# Altium project Cool.PrjPCB
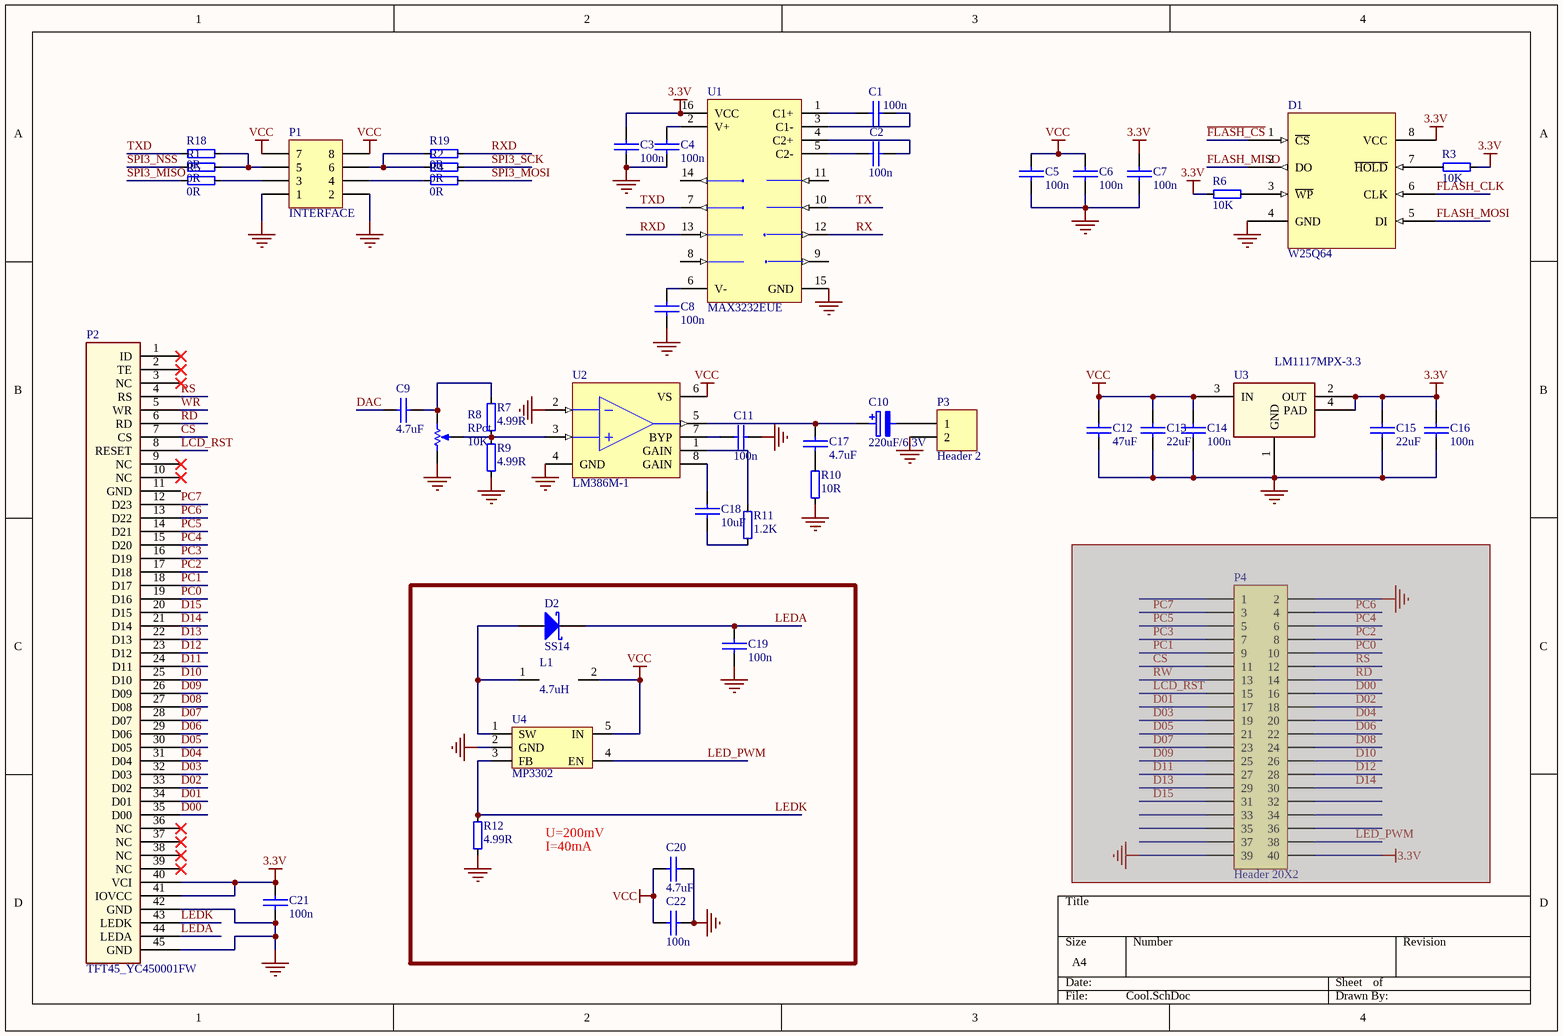
[diagram p0: Cool.SchDoc]
2 sheets, 69 parts. Net scope: global (net labels, ports and power ports of the same name join across sheets).
Board file: Cool.PcbDoc
Sheets:
  Cool.SchDoc
  mcu.SchDoc

## Sheet Cool.SchDoc
size A4

### Parts
C1  100n  [0603]
C2  100n  [0603]
C3  100n  [0603]
C4  100n  [0603]
C5  100n  [0603]
C6  100n  [0603]
C7  100n  [0603]
C8  100n  [0603]
C9  4.7uF  [0603]
C10  220uF/6.3V  [6032]
C11  100n  [0603]
C12  47uF  [1206]
C13  22uF  [1206]
C14  100n  [0603]
C15  22uF  [1206]
C16  100n  [0603]
C17  4.7uF  [0603]
C18  10uF  [0603]
C19  100n  [0603]
C20  4.7uF  [0603]
C21  100n  [0603]
C22  100n  [0603]
D1  W25Q64  [SOIC127P790X200-8N]
D2  SS14  [SOD123]
L1  4.7uH  [SMD4532]
P1  INTERFACE  [P_Head_2x4]
P2  TFT45_YC450001FW  [FPC45]
P3  Header 2  [P_Head_2]
P4  Header 20X2  [P_Head_2x20]  (masked out: inside a compile mask, not in the netlist)
R1  0R  [0603]
R2  0R  [0603]
R3  10K  [0603]
R4  0R  [0603]
R5  0R  [0603]
R6  10K  [0603]
R7  4.99R  [0603]
R8  RPot  value 10K  [VR5]
R9  4.99R  [0603]
R10  10R  [0603]
R11  1.2K  [0603]
R12  4.99R  [0603]
R18  0R  [0603]
R19  0R  [0603]
U1  MAX3232EUE  [TSSOP16]
U2  LM386M-1  [M08A_N]
U3  LM1117MPX-3.3  [SOT223]
U4  MP3302  [sot23-5]

### Nets
3.3V: C3.2 C7.1 C15.1 C16.1 C21.2 D1.8(VCC) P2.40(VCI) P2.41(IOVCC) R3.2 R6.1 U1.16(VCC) U3.2(OUT) U3.4(PAD)
GND: C3.1 C4.1 C5.2 C6.2 C7.2 C8.1 C11.2 C12.2 C13.2 C14.2 C15.2 C16.2 C19.1 C20.2 C21.1 C22.2 D1.4(GND) P1.1 P1.2 P2.42(GND) P2.45(GND) P3.2 R8.1(TOP) R9.1 R10.1 R12.1 U1.15(GND) U2.2(IN-) U2.4(GND) U3.1(GND) U4.2(GND)
VCC: C5.1 C6.1 C12.1 C13.1 C14.1 C20.1 C22.1 L1.2 P1.7 P1.8 U2.6(VS) U3.3(IN) U4.5(IN)
CS: P2.7(CS)
D00: P2.35(D00)
D01: P2.34(D01)
D02: P2.33(D02)
D03: P2.32(D03)
D04: P2.31(D04)
D05: P2.30(D05)
D06: P2.29(D06)
D07: P2.28(D07)
D08: P2.27(D08)
D09: P2.26(D09)
D10: P2.25(D10)
D11: P2.24(D11)
D12: P2.23(D12)
D13: P2.22(D13)
D14: P2.21(D14)
D15: P2.20(D15)
DAC: C9.2
~{FLASH_CS}: D1.1(~{CS})
FLASH_CLK: D1.6(CLK)
FLASH_MISO: D1.2(DO)
FLASH_MOSI: D1.5(DI)
LCD_RST: P2.8(RESET)
LED_PWM: U4.4(EN)
LEDA: C19.2 D2.2(K) P2.44(LEDA)
LEDK: P2.43(LEDK) R12.2 U4.3(FB)
PC0: P2.19(D16)
PC1: P2.18(D17)
PC2: P2.17(D18)
PC3: P2.16(D19)
PC4: P2.15(D20)
PC5: P2.14(D21)
PC6: P2.13(D22)
PC7: P2.12(D23)
RD: P2.6(RD)
RS: P2.4(RS)
RX: U1.12(R1OUT)
RXD: R19.2 U1.13(R1IN)
SPI3_MISO: R5.1
SPI3_MOSI: R4.2
SPI3_NSS: R1.1
SPI3_SCK: R2.2
TX: U1.10(T2IN)
TXD: R18.1 U1.7(T2OUT)
WR: P2.5(WR)
NetC1_1: C1.1 U1.1(C1+)
NetC1_2: C1.2 U1.3(C1-)
NetC2_1: C2.1 U1.5(C2-)
NetC2_2: C2.2 U1.4(C2+)
NetC4_2: C4.2 U1.2(V+)
NetC8_2: C8.2 U1.6(V-)
NetC9_1: C9.1 R7.2 R8.2(BOT)
NetC10_1: C10.1 C17.1 U2.5(OUT)
NetC10_2: C10.2 P3.1
NetC11_1: C11.1 U2.7(BYP)
NetC17_2: C17.2 R10.2
NetC18_1: C18.1 U2.8(GAIN)
NetC18_2: C18.2 R11.1
NetD1_3: D1.3(~{WP}) R6.2
NetD1_7: D1.7(~{HOLD}) R3.1
NetD2_1: D2.1(A) L1.1 U4.1(SW)
NetP1_3: P1.3 R5.2
NetP1_4: P1.4 R4.1
NetP1_5: P1.5 R1.2 R18.2
NetP1_6: P1.6 R2.1 R19.1
NetR7_1: R7.1 R8.3(TAP) R9.2 U2.3(IN+)
NetR11_2: R11.2 U2.1(GAIN)

Not connected (* = marked no-connect by the designer): P2 1(ID)* 2(TE)* 3(NC)* 9(NC)* 10(NC)* 11(GND) 36(NC)* 37(NC)* 38(NC)* 39(NC)*; U1 8(R2IN) 9(R2OUT) 11(T1IN) 14(T1OUT)

### Notes on the sheet
- U=200mV
- I=40mA

### Library data of the parts
C1-C9 C11-C22 = CAP: 贴片瓷片电容
C10 = ELECTRO: 贴片电解电容; Value: 220uF/6.3V
D2 = D Schottky: Schottky Diode; Published: 8-Jun-2000; LatestRevisionDate: 17-Jul-2002; LatestRevisionNote: Re-released for DXP Platform.; PackageReference: SMB; Publisher: Altium Limited; PackageDescription: DO-214-AA/SMB; 2 C-Bend Leads; Body 5.3 x 3.6 mm, inc. leads (LxW); Code_JEDEC: DO-214-AA
L1 = Inductor
P1 = Header 4X2: Header, 4-Pin, Dual row; LatestRevisionDate: 17-Jul-2002; LatestRevisionNote: Re-released for DXP Platform.; Publisher: Altium Limited
P3 = Header 2: Header, 2-Pin; LatestRevisionDate: 17-Jul-2002; LatestRevisionNote: Re-released for DXP Platform.; Publisher: Altium Limited
P4 = Header 20X2: Header, 20-Pin, Dual row; LatestRevisionDate: 17-Jul-2002; LatestRevisionNote: Re-released for DXP Platform.; Publisher: Altium Limited
R1-R7 R9-R12 R18 R19 = RES: 贴片电阻（5%）
R8 = RPot: Potentiometer; Sim Note: Enter the Resistance value and the set point into parameter fields.; Set Position: 0.5; Published: 8-Jun-2000; LatestRevisionDate: 17-Jul-2002; LatestRevisionNote: Re-released for DXP Platform.; PackageReference: VR5; Publisher: Altium Limited
U1 = MAX3232EUE: 3.0V TO 5.5V, Low-Power, up to 1Mbps, True RS-232 Transceiver Using Four 0.1µF External Capacitor; Published: 16-Jan-2001; LatestRevisionDate: 06-Jun-2005; LatestRevisionNote: Stylized 3D Model Added.; DatasheetVersion: Mar-1999; PackageVersion: 21-0066 C; PackageReference: TSSOP16; Publisher: Altium Limited; PackageDescription: Shrink Small Outline; 16 Leads; Body Width 4.4 mm; Pitch 0.65 mm; ComponentLink1Description: Manufacturer Link; ComponentLink1URL: http://www.maxim-ic.com/; ComponentLink2Description: Datasheet; ComponentLink2URL: http://pdfserv.maxim-ic.com/en/ds/MAX3222-MAX3241.pdf
U2 = LM386M-1: Low-Voltage Audio Power Amplifier; Published: 15-Apr-2002; LatestRevisionDate: 13-Apr-2006; LatestRevisionNote: IPC-7351 Footprint Added.; DatasheetVersion: Sep-1997; PackageVersion: Sep-1997; PackageReference: M08A; Publisher: Altium Limited; PackageDescription: 8-Pin Small Outline Integrated Circuit 1.27 mm Pitch; Code_JEDEC: MS-012-AA; Code_IPC: SOIC127P600-8; ComponentLink1Description: Manufacturer Link; ComponentLink1URL: http://www.national.com/; ComponentLink2Description: Datasheet; ComponentLink2URL: http://www.national.com/ds.cgi/LM/LM386.pdf; ComponentLink3Description: URL Link1; ComponentLink3URL: http://www.national.com/pf/LM/LM386.html
U3 = LM1117: 电源LDO

## Sheet mcu.SchDoc
size A4
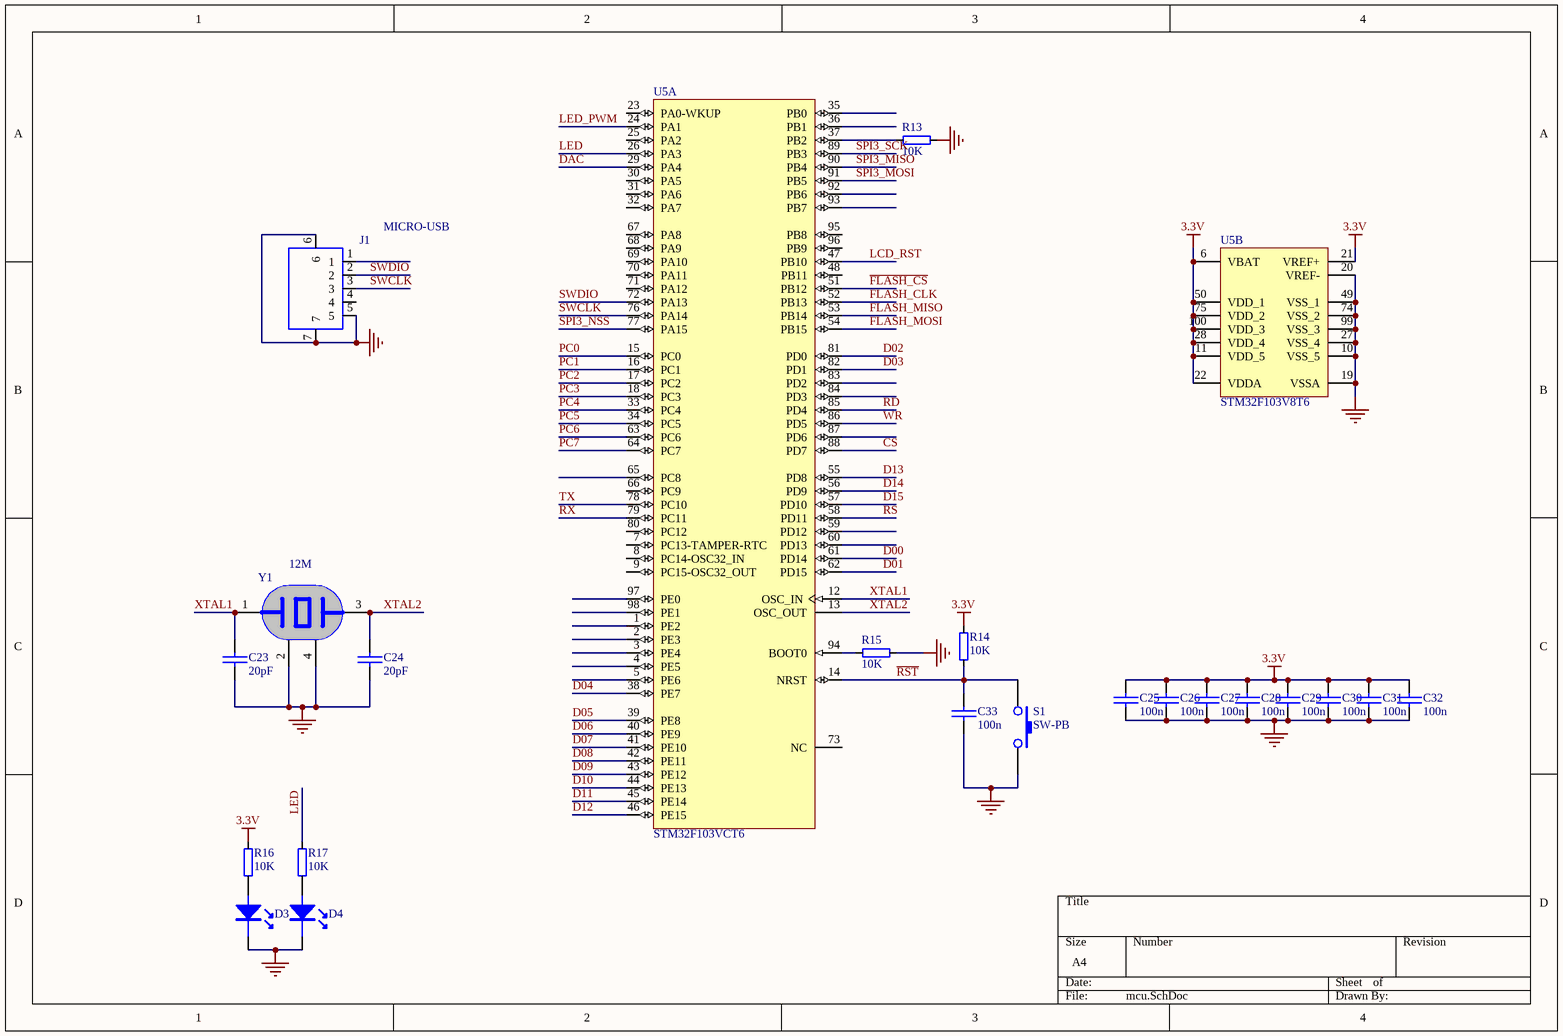
[diagram p1: mcu.SchDoc]

### Parts
C23  20pF  [0603]
C24  20pF  [0603]
C25  100n  [0603]
C26  100n  [0603]
C27  100n  [0603]
C28  100n  [0603]
C29  100n  [0603]
C30  100n  [0603]
C31  100n  [0603]
C32  100n  [0603]
C33  100n  [0603]
D3  LED  [0603-LED]  (value not drawn)
D4  LED  [0603-LED]  (value not drawn)
J1  MICRO-USB  [MICRO-USB]
R13  10K  [0603]
R14  10K  [0603]
R15  10K  [0603]
R16  10K  [0603]
R17  10K  [0603]
S1  SW-PB  [KEY6*4]
U5  STM32F103VCT6  [STM-LQFP100_N]  (parts A,B of 2)
Y1  12M  [XTAL-SMD3225]

### Nets
3.3V: C25.1 C26.1 C27.1 C28.1 C29.1 C30.1 C31.1 C32.1 R14.2 R16.2 U5.6(VBAT) U5.11(VDD_5) U5.21(VREF+) U5.22(VDDA) U5.28(VDD_4) U5.50(VDD_1) U5.75(VDD_2) U5.100(VDD_3)
GND: C23.2 C24.2 C25.2 C26.2 C27.2 C28.2 C29.2 C30.2 C31.2 C32.2 C33.2 D3.2(K) D4.2(K) J1.5 J1.6 J1.7 R13.2 R15.2 S1.2 U5.10(VSS_5) U5.19(VSSA) U5.20(VREF-) U5.27(VSS_4) U5.49(VSS_1) U5.74(VSS_2) U5.99(VSS_3) Y1.2 Y1.4
CS: U5.88(PD7)
D00: U5.61(PD14)
D01: U5.62(PD15)
D02: U5.81(PD0)
D03: U5.82(PD1)
D04: U5.38(PE7)
D05: U5.39(PE8)
D06: U5.40(PE9)
D07: U5.41(PE10)
D08: U5.42(PE11)
D09: U5.43(PE12)
D10: U5.44(PE13)
D11: U5.45(PE14)
D12: U5.46(PE15)
D13: U5.55(PD8)
D14: U5.56(PD9)
D15: U5.57(PD10)
DAC: U5.29(PA4)
~{FLASH_CS}: U5.51(PB12)
FLASH_CLK: U5.52(PB13)
FLASH_MISO: U5.53(PB14)
FLASH_MOSI: U5.54(PB15)
LCD_RST: U5.47(PB10)
LED: R17.2 U5.26(PA3)
LED_PWM: U5.24(PA1)
PC0: U5.15(PC0)
PC1: U5.16(PC1)
PC2: U5.17(PC2)
PC3: U5.18(PC3)
PC4: U5.33(PC4)
PC5: U5.34(PC5)
PC6: U5.63(PC6)
PC7: U5.64(PC7)
~{RST}: C33.1 R14.1 S1.1 U5.14(NRST)
RD: U5.85(PD4)
RS: U5.58(PD11)
RX: U5.79(PC11)
SPI3_MISO: U5.90(PB4)
SPI3_MOSI: U5.91(PB5)
SPI3_NSS: U5.77(PA15)
SPI3_SCK: U5.89(PB3)
SWCLK: J1.3 U5.76(PA14)
SWDIO: J1.2 U5.72(PA13)
TX: U5.78(PC10)
WR: U5.86(PD5)
XTAL1: C23.1 U5.12(OSC_IN) Y1.1
XTAL2: C24.1 U5.13(OSC_OUT) Y1.3
NetD3_1: D3.1(A) R16.1
NetD4_1: D4.1(A) R17.1
NetR13_1: R13.1 U5.37(PB2)
NetR15_1: R15.1 U5.94(BOOT0)

Not connected (* = marked no-connect by the designer): J1 1 4; U5 1(PE2) 2(PE3) 3(PE4) 4(PE5) 5(PE6) 7(PC13-TAMPER-RTC) 8(PC14-OSC32_IN) 9(PC15-OSC32_OUT) 23(PA0-WKUP) 25(PA2) 30(PA5) 31(PA6) 32(PA7) 35(PB0) 36(PB1) 48(PB11) 59(PD12) 60(PD13) 65(PC8) 66(PC9) 67(PA8) 68(PA9) 69(PA10) 70(PA11) 71(PA12) 73(NC) 80(PC12) 83(PD2) 84(PD3) 87(PD6) 92(PB6) 93(PB7) 95(PB8) 96(PB9) 97(PE0) 98(PE1)

### Library data of the parts
C23-C33 = CAP: 贴片瓷片电容
D3 D4 = LED: 贴片发光二极管
J1 = MICRO-USB: Micro USB插座
R13-R17 = RES: 贴片电阻（5%）
S1 = SW-PB: 按钮开关
U5 = STM32F103V8T6: ARM Cortex-M3 32-bit MCU, 64 KB Flash, 20 KB Internal RAM, 80 I/Os, 100-pin LQFP, -40 to 85 degC, Tray; A/D Converter: 2x12-bit (16 channel); FLASH Size (Prog) (kB): 64; I/Os (High Current): 80; Internal RAM Size (kB): 20; Operating Frequency(F) (Processor speed) (MHz): 72; Supply Voltage(Vcc) min (V): 2; DatasheetVersion: Rev. 16; PackageVersion: Rev. 1, 06/2013; PackageReference: LQFP100; PackageDescription: 100-Pin Low Profile Quad Flat Package, 14 x 14 mm Body, 0.5 mm Pitch; Supplier 1: Digi-Key; Supplier Part Number 1: 497-6068-ND; Supplier 2: Farnell; Supplier Part Number 2: 1447639; Supplier 3: Newark; Supplier Part Number 3: 59M2187; Supplier 4: Mouser; Supplier Part Number 4: 511-STM32F103V8T6; Core: ARM Cortex-M3; Packing: Tray; Mounting Technology: Surface Mount; PartNumber: STM32F103V8T6; ComponentLink1Description: Manufacturer URL; ComponentLink1URL: http://www.st.com/web/en/home.html; ComponentLink2Description: Datasheet; ComponentLink2URL: http://www.st.com/st-web-ui/static/active/en/resource/technical/document/datasheet/CD00161566.pdf; ComponentLink3Description: Package Specification; ComponentLink3URL: http://www.st.com/st-web-ui/static/active/en/resource/technical/document/data_brief/DM00071938.pdf
Y1 = XTAL4: 晶振

## Nets that join several sheets
3.3V: Cool (13 pins), mcu (18 pins)
GND: Cool (31 pins), mcu (28 pins)
CS: Cool (P2.7), mcu (U5.88)
D00: Cool (P2.35), mcu (U5.61)
D01: Cool (P2.34), mcu (U5.62)
D02: Cool (P2.33), mcu (U5.81)
D03: Cool (P2.32), mcu (U5.82)
D04: Cool (P2.31), mcu (U5.38)
D05: Cool (P2.30), mcu (U5.39)
D06: Cool (P2.29), mcu (U5.40)
D07: Cool (P2.28), mcu (U5.41)
D08: Cool (P2.27), mcu (U5.42)
D09: Cool (P2.26), mcu (U5.43)
D10: Cool (P2.25), mcu (U5.44)
D11: Cool (P2.24), mcu (U5.45)
D12: Cool (P2.23), mcu (U5.46)
D13: Cool (P2.22), mcu (U5.55)
D14: Cool (P2.21), mcu (U5.56)
D15: Cool (P2.20), mcu (U5.57)
DAC: Cool (C9.2), mcu (U5.29)
~{FLASH_CS}: Cool (D1.1), mcu (U5.51)
FLASH_CLK: Cool (D1.6), mcu (U5.52)
FLASH_MISO: Cool (D1.2), mcu (U5.53)
FLASH_MOSI: Cool (D1.5), mcu (U5.54)
LCD_RST: Cool (P2.8), mcu (U5.47)
LED_PWM: Cool (U4.4), mcu (U5.24)
PC0: Cool (P2.19), mcu (U5.15)
PC1: Cool (P2.18), mcu (U5.16)
PC2: Cool (P2.17), mcu (U5.17)
PC3: Cool (P2.16), mcu (U5.18)
PC4: Cool (P2.15), mcu (U5.33)
PC5: Cool (P2.14), mcu (U5.34)
PC6: Cool (P2.13), mcu (U5.63)
PC7: Cool (P2.12), mcu (U5.64)
RD: Cool (P2.6), mcu (U5.85)
RS: Cool (P2.4), mcu (U5.58)
RX: Cool (U1.12), mcu (U5.79)
SPI3_MISO: Cool (R5.1), mcu (U5.90)
SPI3_MOSI: Cool (R4.2), mcu (U5.91)
SPI3_NSS: Cool (R1.1), mcu (U5.77)
SPI3_SCK: Cool (R2.2), mcu (U5.89)
TX: Cool (U1.10), mcu (U5.78)
WR: Cool (P2.5), mcu (U5.86)